# EasyEDA schematic Pulsera con GND.json
TITLE: Pulsera (Wristband); REV: 1.0; Date: 2019-05-02; Sheet: 1/1; Drawn By: Gabriel Maxemin; Company: City Jumper
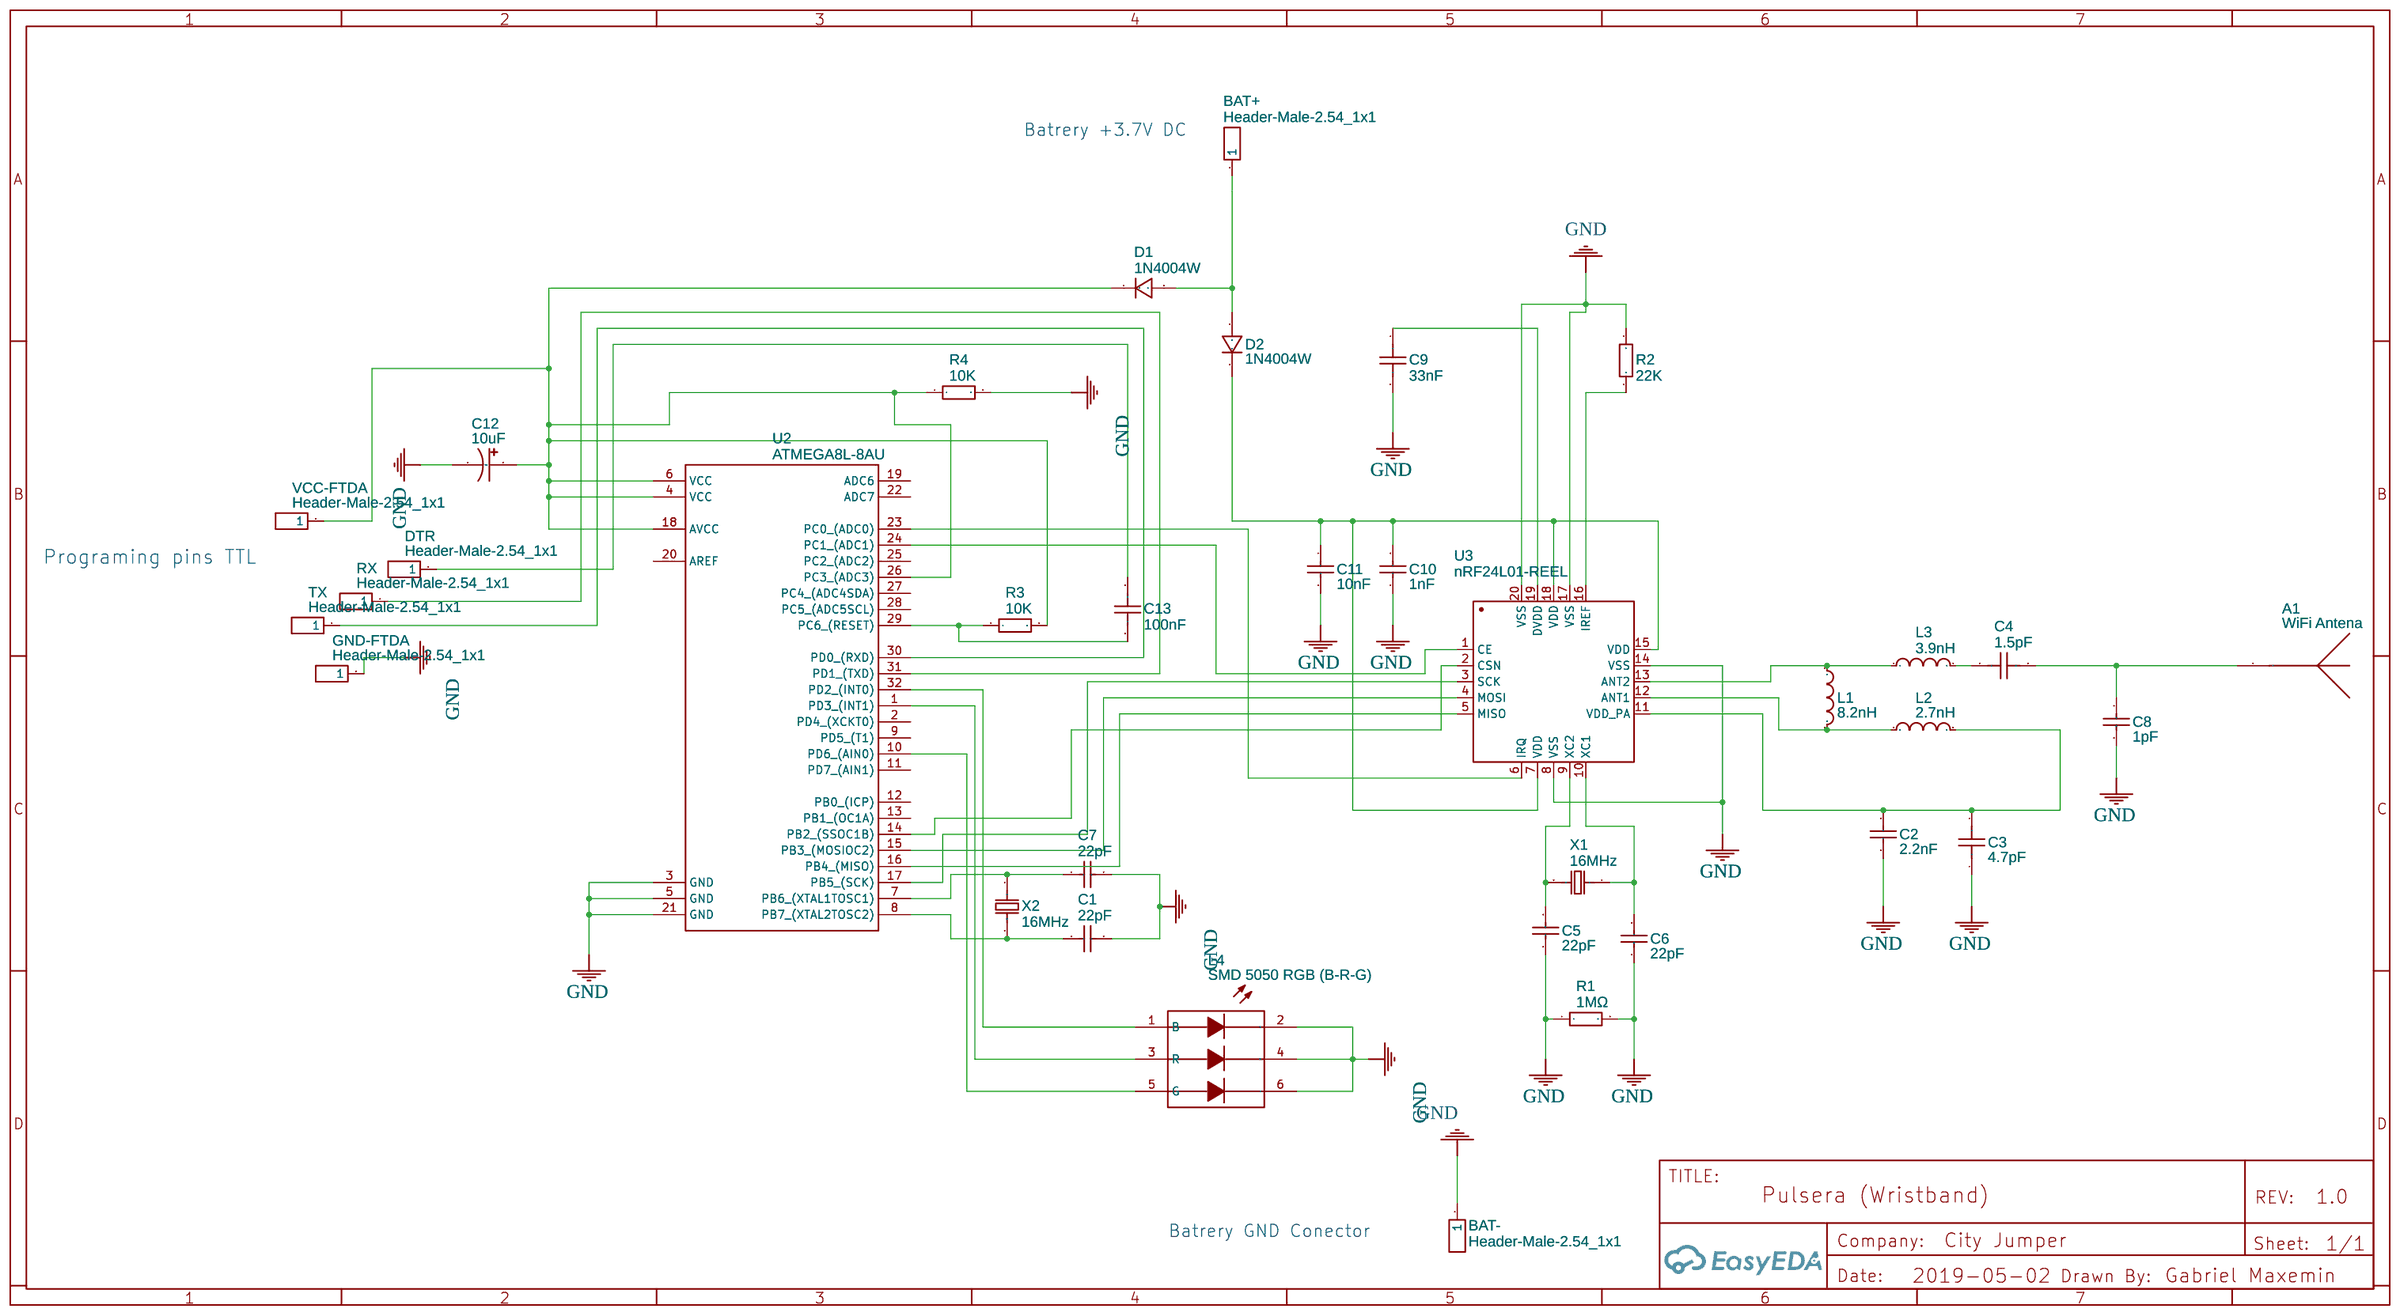
[diagram p0: schematic sheet]

## Parts
A1  WiFi Antena  [WIFI ANTENA]
BAT+  Header-Male-2.54_1x1  [HDR-1X1/2.54]
BAT-  Header-Male-2.54_1x1  [HDR-1X1/2.54]
C1  22pF  [0402]
C2  2.2nF  [0402]
C3  4.7pF  [0402]
C4  1.5pF  [0402]
C5  22pF  [0402]
C6  22pF  [0402]
C7  22pF  [0402]
C8  1pF  [0402]
C9  33nF  [0402]
C10  1nF  [0402]
C11  10nF  [0402]
C12  10uF  [SMD,4X5.4MM]
C13  100nF  [0402]
D1  1N4004W  [DIODE_SOD-123FL]
D2  1N4004W  [DIODE_SOD-123FL]
DTR  Header-Male-2.54_1x1  [HDR-1X1/2.54]
GND-FTDA  Header-Male-2.54_1x1  [HDR-1X1/2.54]
L1  8.2nH  [0402]
L2  2.7nH  [0402]
L3  3.9nH  [0402]
L4  SMD 5050 RGB (B-R-G)  [SMD 5050 RGB]
R1  1MΩ  [0402]
R2  22K  [0402]
R3  10K  [0402]
R4  10K  [0402]
RX  Header-Male-2.54_1x1  [HDR-1X1/2.54]
TX  Header-Male-2.54_1x1  [HDR-1X1/2.54]
U2  ATMEGA8L-8AU  [TQFP-32_7X7X08P]
U3  nRF24L01-REEL  [QFN-20_4X4X05P]
VCC-FTDA  Header-Male-2.54_1x1  [HDR-1X1/2.54]
X1  16MHz  [HC-49SMD]
X2  16MHz  [HC-49SMD]

## Library data of the parts
A1 = -: Manufacturer Part: New SchematicLib; Contributor: ESPITmove
BAT+ BAT- DTR GND-FTDA RX TX VCC-FTDA = -: Supplier: LCSC; Manufacturer: ReliaPro; Supplier Part: C81276
C1 C5-C7 = 0402CG220J500NT: Supplier: LCSC; Manufacturer: FH; LCSC Assembly: Yes; Supplier Part: C1555
C2 = 0402B222K500NT: Supplier: LCSC; Manufacturer: FH; LCSC Assembly: Yes; Supplier Part: C1531
C3 = GJM1555C1H4R7CB01D: Supplier: LCSC; Manufacturer: MuRata; Supplier Part: C85883
C4 = GJM1555C1H1R5BB01D: Supplier: LCSC; Manufacturer: MuRata; Supplier Part: C76900
C8 = GJM1555C1H1R0BB01D: Supplier: LCSC; Manufacturer: MuRata; Supplier Part: C76898
C9 = GRM155R71E333KA88D: Supplier: LCSC; Manufacturer: MuRata; Supplier Part: C77016
C10 = CL05B102KB5NNNC: Supplier: LCSC; Manufacturer: SAMSUNG; Supplier Part: C14442
C11 = GRM155R71H103KA88D: Supplier: LCSC; Manufacturer: MuRata; Supplier Part: C77019
C12 = EEE1EA100WR: Supplier: LCSC; Supplier Part: C178501; Manufacturer: PANASONIC; Contributor: LCSC
C13 = GRM155R61C104KA88D: Supplier: LCSC; Manufacturer: MuRata; Supplier Part: C77005
D1 D2 = -: Supplier Part: C162734; Supplier: LCSC; Manufacturer: Jingdao; Contributor: LCSC; LCSC Assembly: Yes
L1 = SDCL1005C8N2JTDF: Supplier: LCSC; Manufacturer: Sunlord; LCSC Assembly: Yes; Supplier Part: C16208
L2 = SDCL1005C2N7STDF: Supplier: LCSC; Manufacturer: Sunlord; LCSC Assembly: Yes; Supplier Part: C27123
L3 = SDCL1005C3N9STDF: Supplier: LCSC; Manufacturer: Sunlord; LCSC Assembly: Yes; Supplier Part: C14033
L4 = -: Contributor: Se_Vi
R1 = -: Power: 1/16W; Tolerance: ±1%; Supplier Part: 603-RC0402FR-071ML; Supplier: Mouser; Manufacturer: Yageo; Manufacturer Part: RC0402FR-071ML; LCSC: C25879; LCSC Assembly: Yes
R2 = 0402WGJ0223TCE: Supplier: LCSC; Manufacturer: UniOhm; Supplier Part: C25547
R3 R4 = 0402WGJ0103TCE: Supplier: LCSC; Manufacturer: UniOhm; Supplier Part: C25531
U2 = -: Supplier: LCSC; Manufacturer: MICROCHIP; image: //image.lceda.cn/szlcsc/C9755.jpg; Supplier Part: C9755
U3 = -: Supplier: LCSC; Manufacturer: NORDIC; Supplier Part: C93664
X1 X2 = X49SSM16MSD2SI: Supplier: LCSC; Manufacturer: YXC; Supplier Part: C96138

## Nets
GND: BAT-.1 C1.2 C2.1 C3.1 C5.1 C6.1 C7.2 C8.2 C9.2 C10.1 C11.2 C12.2 GND-FTDA.1 L4.2(B-) L4.4(R-) L4.6(-g) R1.1 R1.2 R2.2 R4.2 U2.3(GND) U2.5(GND) U2.21(GND) U3.8(VSS) U3.14(VSS) U3.17(VSS) U3.20(VSS)
C2_2: C2.2 C3.2 L2.2 U3.11(VDD_PA)
C9_1: C9.1 U3.19(DVDD)
C10_2: C10.2 C11.1 D2.1 U3.7(VDD) U3.15(VDD) U3.18(VDD)
C13_2: C13.2 DTR.1
D1_2: BAT+.1 D1.2 D2.2
L1_1: L1.1 L3.1 U3.13(ANT2)
L1_2: L1.2 L2.1 U3.12(ANT1)
L4_1: L4.1(B) U2.32(PD2 (INT0))
L4_3: L4.3(R) U2.1(PD3 (INT1))
L4_5: L4.5(G) U2.10(PD6 (AIN0))
Net-(A1-1): A1.1 C4.2 C8.1
Net-(C4-1): C4.1 L3.2
Net-(C12-1): C12.1 D1.1 R3.2 R4.1 U2.4(VCC) U2.6(VCC) U2.18(AVCC) U2.26(PC3 (ADC3)) VCC-FTDA.1
R2_1: R2.1 U3.16(IREF)
R3_1: C13.1 R3.1 U2.29(PC6 (RESET))
U2_30: TX.1 U2.30(PD0 (RXD))
U2_31: RX.1 U2.31(PD1 (TXD))
U3_1: U2.24(PC1 (ADC1)) U3.1(CE)
U3_2: U2.14(PB2 (SSOC1B)) U3.2(CSN)
U3_3: U2.17(PB5 (SCK)) U3.3(SCK)
U3_4: U2.15(PB3 (MOSIOC2)) U3.4(MOSI)
U3_5: U2.16(PB4 (MISO)) U3.5(MISO)
U3_6: U2.23(PC0 (ADC0)) U3.6(IRQ)
X1_1: C6.2 U3.10(XC1) X1.1
X1_2: C5.2 U3.9(XC2) X1.2
X2_1: C7.1 U2.7(PB6 (XTAL1TOSC1)) X2.1
X2_2: C1.1 U2.8(PB7 (XTAL2TOSC2)) X2.2

Not connected (* = marked no-connect by the designer): U2 2(PD4 (XCKT0)) 9(PD5 (T1)) 11(PD7 (AIN1)) 12(PB0 (ICP)) 13(PB1 (OC1A)) 19(ADC6) 20(AREF) 22(ADC7) 25(PC2 (ADC2)) 27(PC4 (ADC4SDA)) 28(PC5 (ADC5SCL))

## Notes on the sheet
- Batrery +3.7V DC
- Programing pins TTL
- Batrery GND Conector
